# Altium schematic sheet COM.SchDoc
size A4
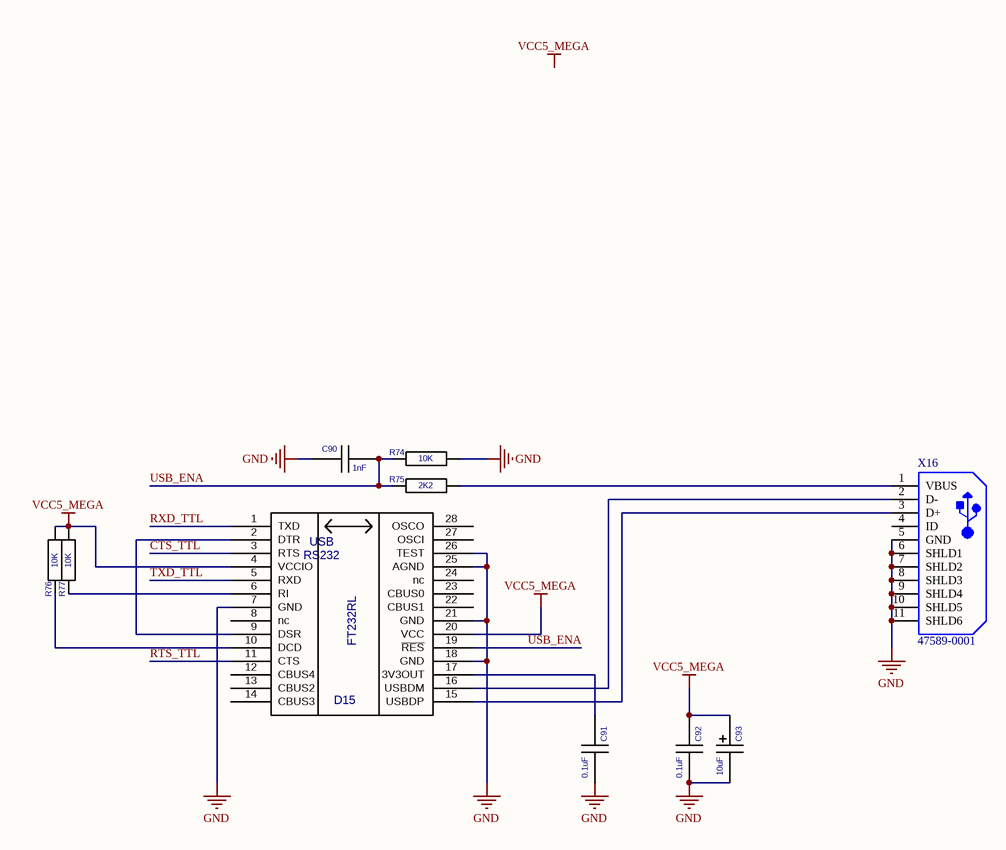
[diagram p0: COM.SchDoc]

## Parts
C90  value 1nF  [C-CHIP]  (hidden comment: CAPCHIP)
C91  value 0.1uF  [C-CHIP]  (hidden comment: CAPCHIP)
C92  value 0.1uF  [C-CHIP]  (hidden comment: CAPCHIP)
C93  value 10uF  [EC-CHIP]  (hidden comment: ECAPCHIP)
D15  FT232RL  [SSOP28]
R74  value 10K  [R-CHIP]  (hidden comment: RESCHIP)
R75  value 2K2  [R-CHIP]  (hidden comment: RESCHIP)
R76  value 10K  [R-CHIP]  (hidden comment: RESCHIP)
R77  value 10K  [R-CHIP]  (hidden comment: RESCHIP)
X16  47589-0001  [MOLX-47589-0001_V]

## Nets
GND: C90.1 C91.2 C92.2 C93.2 D15.7(GND) D15.18(GND) D15.21(GND) D15.25(AGND) D15.26(TEST) R74.1(i/o) X16.5(GND) X16.6(SHLD1) X16.7(SHLD2) X16.8(SHLD3) X16.9(SHLD4) X16.10(SHLD5) X16.11(SHLD6)
VCC5_MEGA: C92.1 C93.1 D15.4(VCCIO) D15.20(VCC) R76.1(i/o) R77.1(i/o)
CTS_TTL: D15.3(RTS)
RTS_TTL: D15.11(CTS)
RXD_TTL: D15.1(TXD)
TXD_TTL: D15.5(RXD)
USB_ENA: C90.2 D15.19(~{RES}) R74.2(i/o1) R75.2(i/o1)
NetC91_1: C91.1 D15.17(3V3OUT)
NetD15_2: D15.2(DTR) D15.9(DSR)
NetD15_6: D15.6(RI) R77.2(i/o1)
NetD15_10: D15.10(DCD) R76.2(i/o1)
NetD15_15: D15.15(USBDP) X16.3(D+)
NetD15_16: D15.16(USBDM) X16.2(D-)
NetR75_1: R75.1(i/o) X16.1(VBUS)

Not connected (* = marked no-connect by the designer): D15 8(nc) 12(CBUS4) 13(CBUS2) 14(CBUS3) 22(CBUS1) 23(CBUS0) 24(nc) 27(OSCI) 28(OSCO); X16 4(ID)

## Notes on the sheet
- Labels drawn without touching a wire or pin: VCC5_MEGA
- (in symbol FT232RL) USB; RS232

## Library data of the parts
X16 = CMP-2000-05610-1: Right Angle Female Type AB Micro USB Connector, 30 V, 1.8 A, -30 to 85 degC, RoHS, Tape and Reel; Number of Ports: 1Port; Current Rating: 1.8A; Brand: Molex; Connector Type: MicroUSBTypeABreceptacle; Number of Contacts: 5Contact; Voltage Rating: 30VAC; Color: Black; Product: MicroUSBTypeABConnectors; Package URL: http://www.molex.com/pdm_docs/sd/475890001_sd.pdf; Contact Plating: Gold; Datasheet URL: http://www.molex.com/webdocs/datasheets/pdf/en-us/0475890001_IO_CONNECTORS.pdf; Operating Temperature Range: -20Cto+85C; Termination Style: SMD/SMT; Mounting Angle: Right; Package Reference: 47589-0001; Gender: Female; Package Description: Micro USB Connector, Pitch 0.65 mm, 5 Positions, Body 7.5 x 5.6 mm; Mounting Technology: SurfaceMount; Contact Material: CopperAlloy; Packaging: Reel; RoHS: True; Standard: USB; Manufacturer URL: http://www.molex.com/; Manufacturer: Molex; Datasheet Version: 12/2016; Product Category: USBConnectors; Series: 47589
D15 = FT232RL: Value: *